# Altium schematic sheet ADCLK.SchDoc: FIT_PM12 board
size 420 x 297 mm; CheckedBy: G.Kasprowicz; Author: INR Moscow; CompanyName: WUT ISE; DrawnBy: M.Podgórski; Organization: WUT ISE; Address1: PW ISE; Address2: Nowowiejska 15/19 00-665 Warsaw; Address3: gkasprow@gmail.com; DocumentNumber: 10; Revision: 2; SheetNumber: 3; SheetTotal: 34; ModifiedBy: -; CheckedDate: -; Title2: clock distribution; DivGrp: WUT ISE; Designer: INR RAS; ModifiedDate: -; ProjectName: Sensor Box
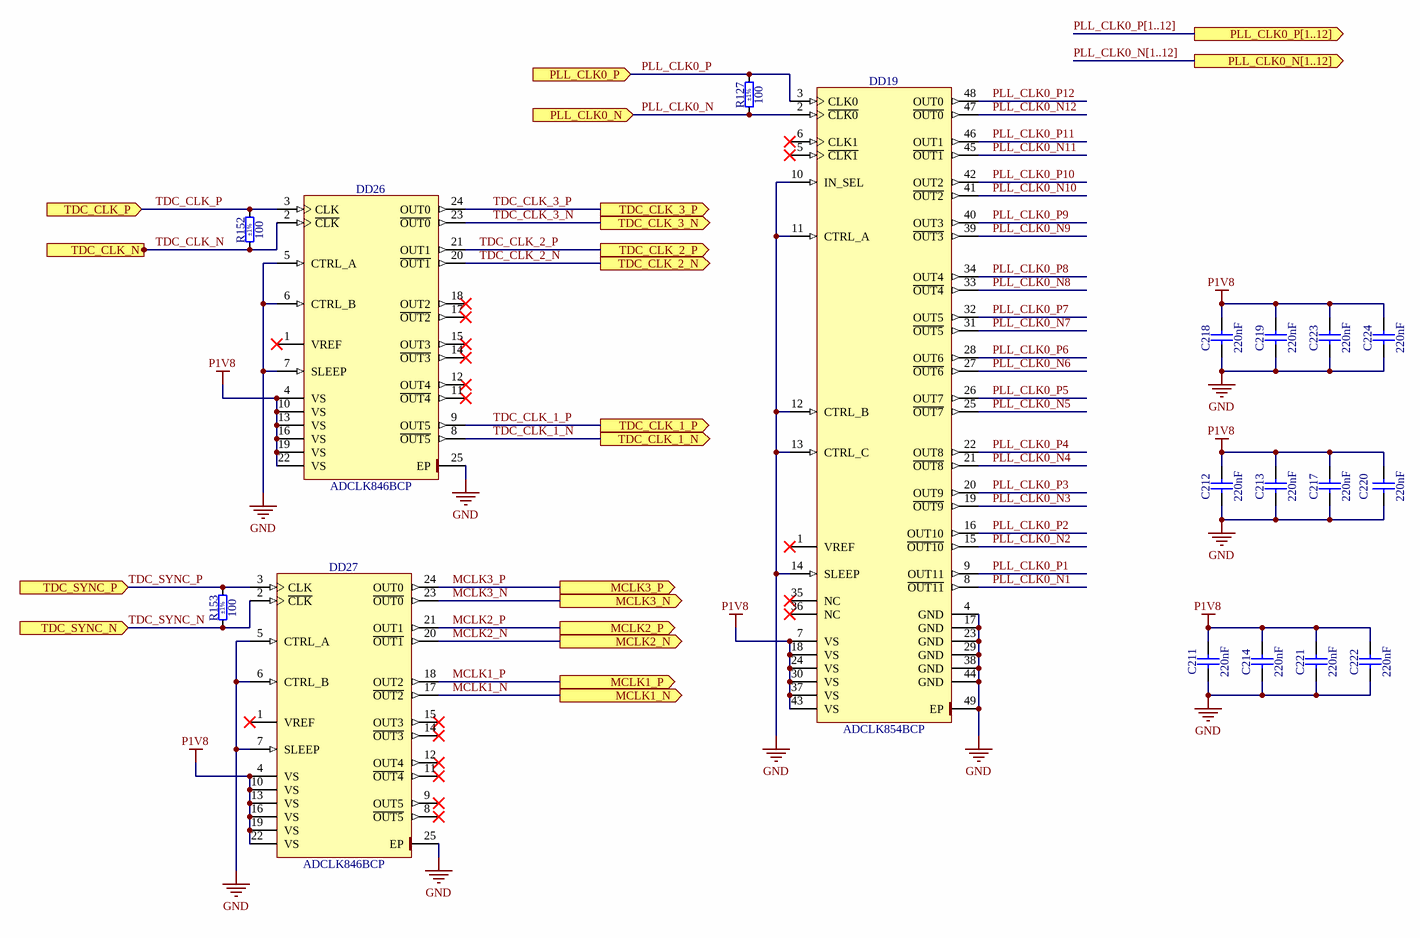
[diagram p0: ADCLK.SchDoc]

## Parts
C211  220nF  [CAPC2012X135N]
C212  220nF  [CAPC2012X135N]
C213  220nF  [CAPC2012X135N]
C214  220nF  [CAPC2012X135N]
C217  220nF  [CAPC2012X135N]
C218  220nF  [CAPC2012X135N]
C219  220nF  [CAPC2012X135N]
C220  220nF  [CAPC2012X135N]
C221  220nF  [CAPC2012X135N]
C222  220nF  [CAPC2012X135N]
C223  220nF  [CAPC2012X135N]
C224  220nF  [CAPC2012X135N]
DD19  ADCLK854BCP  [QFN50P700X700X80-49N-S290]
DD26  ADCLK846BCP  [QFN50P400X400X80-25N-S245]
DD27  ADCLK846BCP  [QFN50P400X400X80-25N-S245]
R127  100  Tolerance: ±1%  [RESC1608X55N]
R152  100  Tolerance: ±1%  [RESC1608X55N]
R153  100  Tolerance: ±1%  [RESC1608X55N]

## Ports
MCLK1_N (out), MCLK1_P (out), MCLK2_N (out), MCLK2_P (out), MCLK3_N (out), MCLK3_P (out), PLL_CLK0_N (in), PLL_CLK0_N[1..12] (out), PLL_CLK0_P (in), PLL_CLK0_P[1..12] (out), TDC_CLK_1_N (out), TDC_CLK_1_P (out), TDC_CLK_2_N (out), TDC_CLK_2_P (out), TDC_CLK_3_N (out), TDC_CLK_3_P (out), TDC_CLK_N (in), TDC_CLK_P (in), TDC_SYNC_N (in), TDC_SYNC_P (in)

## Nets
GND: C211.1 C212.1 C213.1 C214.1 C217.1 C218.1 C219.1 C220.1 C221.1 C222.1 C223.1 C224.1 DD19.4(GND) DD19.10(IN_SEL) DD19.11(CTRL_A) DD19.12(CTRL_B) DD19.13(CTRL_C) DD19.14(SLEEP) DD19.17(GND) DD19.23(GND) DD19.29(GND) DD19.38(GND) DD19.44(GND) DD19.49(EP) DD26.5(CTRL_A) DD26.6(CTRL_B) DD26.7(SLEEP) DD26.25(EP) DD27.5(CTRL_A) DD27.6(CTRL_B) DD27.7(SLEEP) DD27.25(EP)
P1V8: C211.2 C212.2 C213.2 C214.2 C217.2 C218.2 C219.2 C220.2 C221.2 C222.2 C223.2 C224.2 DD19.7(VS) DD19.18(VS) DD19.24(VS) DD19.30(VS) DD19.37(VS) DD19.43(VS) DD26.4(VS) DD26.10(VS) DD26.13(VS) DD26.16(VS) DD26.19(VS) DD26.22(VS) DD27.4(VS) DD27.10(VS) DD27.13(VS) DD27.16(VS) DD27.19(VS) DD27.22(VS)
MCLK1_N: DD27.17(~{OUT2}) ; port MCLK1_N
MCLK1_P: DD27.18(OUT2) ; port MCLK1_P
MCLK2_N: DD27.20(~{OUT1}) ; port MCLK2_N
MCLK2_P: DD27.21(OUT1) ; port MCLK2_P
MCLK3_N: DD27.23(~{OUT0}) ; port MCLK3_N
MCLK3_P: DD27.24(OUT0) ; port MCLK3_P
PLL_CLK0_N: DD19.2(~{CLK0}) R127.1 ; port PLL_CLK0_N
PLL_CLK0_N1: DD19.8(~{OUT11})
PLL_CLK0_N2: DD19.15(~{OUT10})
PLL_CLK0_N3: DD19.19(~{OUT9})
PLL_CLK0_N4: DD19.21(~{OUT8})
PLL_CLK0_N5: DD19.25(~{OUT7})
PLL_CLK0_N6: DD19.27(~{OUT6})
PLL_CLK0_N7: DD19.31(~{OUT5})
PLL_CLK0_N8: DD19.33(~{OUT4})
PLL_CLK0_N9: DD19.39(~{OUT3})
PLL_CLK0_N10: DD19.41(~{OUT2})
PLL_CLK0_N11: DD19.45(~{OUT1})
PLL_CLK0_N12: DD19.47(~{OUT0})
PLL_CLK0_P: DD19.3(CLK0) R127.2 ; port PLL_CLK0_P
PLL_CLK0_P1: DD19.9(OUT11)
PLL_CLK0_P2: DD19.16(OUT10)
PLL_CLK0_P3: DD19.20(OUT9)
PLL_CLK0_P4: DD19.22(OUT8)
PLL_CLK0_P5: DD19.26(OUT7)
PLL_CLK0_P6: DD19.28(OUT6)
PLL_CLK0_P7: DD19.32(OUT5)
PLL_CLK0_P8: DD19.34(OUT4)
PLL_CLK0_P9: DD19.40(OUT3)
PLL_CLK0_P10: DD19.42(OUT2)
PLL_CLK0_P11: DD19.46(OUT1)
PLL_CLK0_P12: DD19.48(OUT0)
TDC_CLK_1_N: DD26.8(~{OUT5}) ; port TDC_CLK_1_N
TDC_CLK_1_P: DD26.9(OUT5) ; port TDC_CLK_1_P
TDC_CLK_2_N: DD26.20(~{OUT1}) ; port TDC_CLK_2_N
TDC_CLK_2_P: DD26.21(OUT1) ; port TDC_CLK_2_P
TDC_CLK_3_N: DD26.23(~{OUT0}) ; port TDC_CLK_3_N
TDC_CLK_3_P: DD26.24(OUT0) ; port TDC_CLK_3_P
TDC_CLK_N: DD26.2(~{CLK}) R152.1 ; port TDC_CLK_N
TDC_CLK_P: DD26.3(CLK) R152.2 ; port TDC_CLK_P
TDC_SYNC_N: DD27.2(~{CLK}) R153.1 ; port TDC_SYNC_N
TDC_SYNC_P: DD27.3(CLK) R153.2 ; port TDC_SYNC_P

Not connected (* = marked no-connect by the designer): DD19 1(VREF)* 5(~{CLK1})* 6(CLK1)* 35(NC)* 36(NC)*; DD26 1(VREF)* 11(~{OUT4})* 12(OUT4)* 14(~{OUT3})* 15(OUT3)* 17(~{OUT2})* 18(OUT2)*; DD27 1(VREF)* 8(~{OUT5})* 9(OUT5)* 11(~{OUT4})* 12(OUT4)* 14(~{OUT3})* 15(OUT3)*

## Buses and harness runs
bus PLL_CLK0_N[1..12] = port PLL_CLK0_N[1..12]
bus PLL_CLK0_P[1..12] = port PLL_CLK0_P[1..12]

## Notes on the sheet
- Project/Equipment
- Document
- Designer
- Drawn by
- Check.by
- Copyright WUT ISE 2024.
  This documentation describes Open Hardware and is licensed under the CERN OHL v.2. You may redistribute and modify this documentation under the terms of the CERN OHL v.2. (http://ohwr.org/CERNOHL). This documentation is distributed WITHOUT ANY EXPRESS OR IMPLIED WARRANTY, INCLUDING OF MERCHANTABILITY, SATISFACTORY QUALITY AND FITNESS FOR A PARTICULAR PURPOSE. Please see the CERN OHL v.2 for applicable conditions.
- Contact
- File
- Last Mod.
- Print Date
- Sheet
- Size
- A3
- of
- Rev

## Library data of the parts
C211-C214 C217-C224 = CC0805_220NF_50V_10%_X7R: Non-polarised capacitor; Part Description: SMD Multilayer Chip Ceramic Capacitor; Manufacturer: GENERIC; Manufacturer1 Part Number: GRM21BR71H224KA01L; Voltage: 50V; TC: X7R; Tolerance: ±10%; Part Number: CC0805_220NF_50V_10%_X7R; Component Kind: Standard; Component Type: Standard; Pin Count: 2; Value: 220nF; Status: Preferred; Manufacturer Part Number: CC0805_220NF_50V_10%_X7R; Case: 0805; Mounted: Yes; Socket: No; SMD: Yes; Sense: No; Manufacturer1 Example: MURATA; Manufacturer1 ComponentHeight: 1.35mm; HelpURL: \\cern.ch\dfs\Applications\Altium\Datasheets\CC0805_X7R_MURATA.pdf; Author: CERN DEM JLC; CreateDate: 03.12.2007; LatestRevisionDate: 03.12.2007
DD19 = ADCLK854BCP: 1.8 V, 6 LVDS/12 CMOS Outputs Low Power Clock Fanout Buffer; Manufacturer: ANALOG DEVICES; PressFit: No; Bonding: No; Part Number: ADCLK854BCP; Component Kind: Standard; Component Type: Standard; Device: ADCLK854BCP; PackageDescription: QFN, 0.50mm Pitch, Square; 48 Pin, 7.00mm L X 7.00mm W X 0.80mm H body (w/Thermal Tab 2.9 x 2.9mm), IPC Medium Density; Part Description: 1.8 V, 6 LVDS/12 CMOS Outputs Low Power Clock Fanout Buffer; Manufacturer Part Number: ADCLK854BCP; Pin Count: 49; Case: QFN48; Mounted: Yes; Socket: No; SMD: Yes; Sense: No; ComponentHeight: 0.8mm; Author: CERN DEM HF; HelpURL: \\cern.ch\dfs\Applications\Altium\Datasheets\ADCLK854BCP.pdf; CreateDate: 24.05.2024; LatestRevisionDate: 24.05.2024
DD26 DD27 = ADCLK846BCP: 1.8 V, 6 LVDS/12 CMOS Outputs Low Power Clock Fanout Buffer; Manufacturer: ANALOG DEVICES; PressFit: No; Bonding: No; Part Number: ADCLK846BCP; Component Kind: Standard; Component Type: Standard; Device: ADCLK846BCP; PackageDescription: QFN, 0.50mm Pitch, Square; 24 Pin, 4.00mm L X 4.00mm W X 0.80mm H body (w/Thermal Tab 2.45 x 2.45mm), IPC Medium Density; Part Description: 1.8 V, 6 LVDS/12 CMOS Outputs Low Power Clock Fanout Buffer; Manufacturer Part Number: ADCLK846BCP; Pin Count: 25; Case: QFN24; Mounted: Yes; Socket: No; SMD: Yes; Sense: No; ComponentHeight: 0.8mm; Author: CERN DEM HF; HelpURL: \\cern.ch\dfs\Applications\Altium\Datasheets\ADCLK846BCP.pdf; CreateDate: 23.05.2024; LatestRevisionDate: 23.05.2024
R127 R152 R153 = R0603_100R_1%_0.1W_100PPM: Resistor - 1%; Part Description: General Purpose Thick Film Chip Resistor; Manufacturer: GENERIC; Manufacturer1 Part Number: NRC06F4700TRF; Power: 0.1W; TC: ±100ppm/°C; PressFit: No; Part Number: R0603_100R_1%_0.1W_100PPM; Component Kind: Standard; Component Type: Standard; Pin Count: 2; Value: 100; Status: Preferred; Manufacturer Part Number: R0603_100R_1%_0.1W_100PPM; Case: 0603; Mounted: Yes; Sense: No; Socket: No; SMD: Yes; Manufacturer1 Example: NIC COMPONENT; Manufacturer1 ComponentHeight: 0.55mm; HelpURL: \\cern.ch\dfs\Applications\Altium\Datasheets\R0603_NIC_NRC.pdf; Author: CERN DEM JLC; CreateDate: 03.12.2007; LatestRevisionDate: 13.03.2008